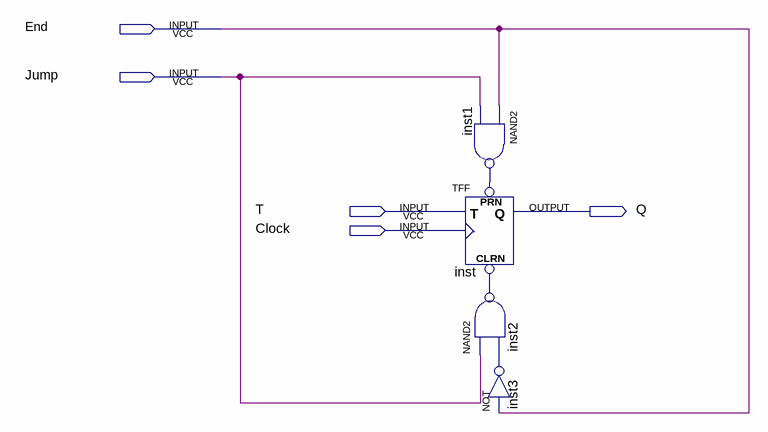
[diagram p0: schematic sheet]
// Quartus schematic TFF_Jump.bdf as structural Verilog: 4 symbols, 5 pins
module TFF_Jump (
  input  End,
  input  Jump,
  input  T,
  input  Clock,
  output Q
);

  wire inst1_out, inst2_out, inst3_out;

  nand inst1 (inst1_out, End, Jump);
  TFF inst (.PRN(inst1_out), .CLRN(inst2_out), .T(T), .CLK(Clock), .Q(Q));
  nand inst2 (inst2_out, Jump, inst3_out);
  not inst3 (inst3_out, End);
endmodule
